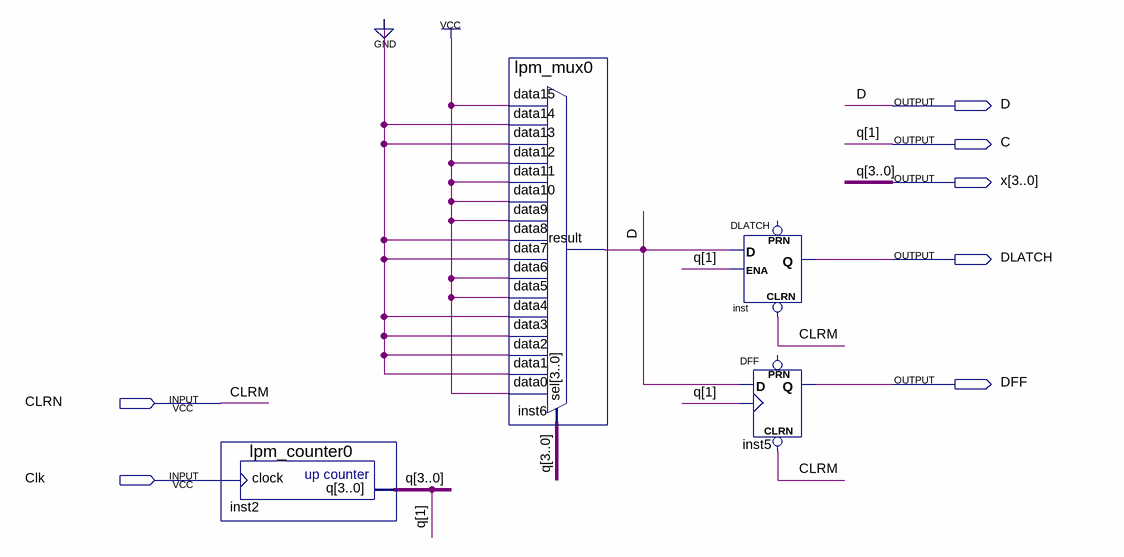
[diagram p0: schematic sheet]
// Quartus schematic D_trigger.bdf as structural Verilog: 4 symbols, 7 pins
module D_trigger (
  input  CLRN,
  input  Clk,
  output D,
  output C,
  output [3:0] x,
  output DLATCH,
  output DFF
);

  lpm_counter0 inst2 (.clock(Clk), .q({x[3:2], C, x[0]}));
  lpm_mux0 inst6 (
    .data15(1'b1), .data14(1'b0), .data13(1'b0), .data12(1'b1), .data11(1'b1), .data10(1'b1), .data9(1'b1),
    .data8(1'b0), .data7(1'b0), .data6(1'b1), .data5(1'b1), .data4(1'b0), .data3(1'b0), .data2(1'b0),
    .data1(1'b0), .data0(1'b1), .sel({x[3:2], C, x[0]}), .result(D));
  DLATCH inst (.CLRN(CLRN), .D(D), .ENA(C), .Q(DLATCH));  // open: PRN
  DFF inst5 (.CLRN(CLRN), .CLK(C), .D(D), .Q(DFF));  // open: PRN

  assign x[1] = C;

  // Other names for the same wires on the sheet: CLRM = CLRN; q[3:0] = {x[3:2], C, x[0]}
endmodule
